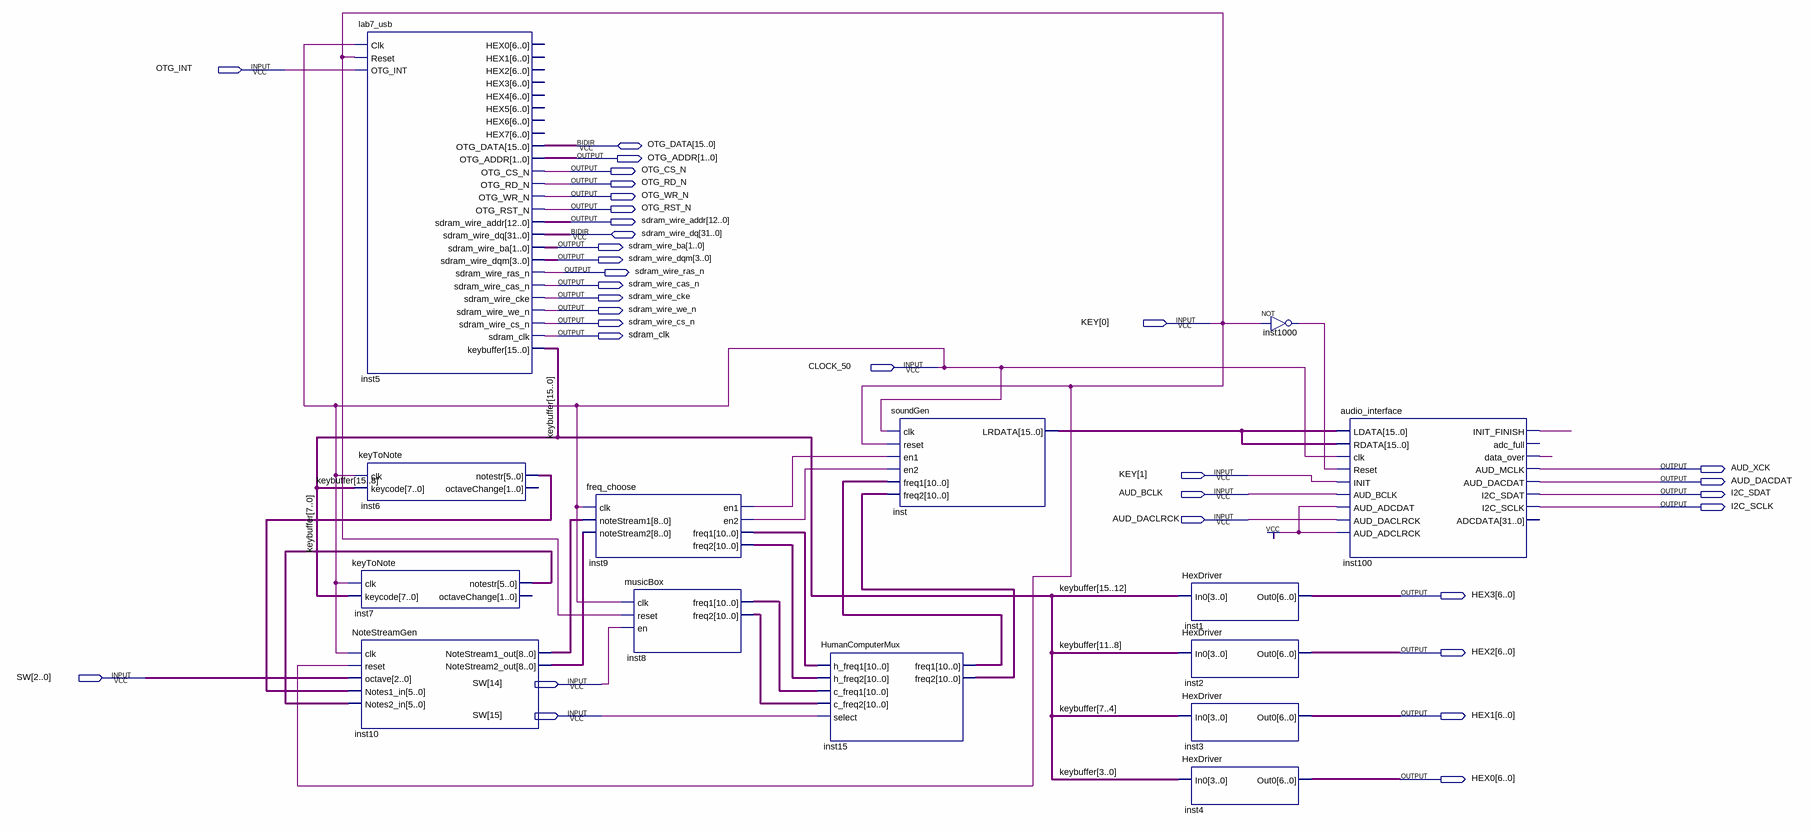
[diagram p0: schematic sheet]
// Quartus schematic Music_Systhesizer.bdf as structural Verilog: 14 symbols, 33 pins
module Music_Systhesizer (
  input  OTG_INT,
  input  [1:0] KEY,
  input  CLOCK_50,
  input  AUD_BCLK,
  input  AUD_DACLRCK,
  input  [15:0] SW,
  inout  [15:0] OTG_DATA,
  inout  [31:0] sdram_wire_dq,
  output [1:0] OTG_ADDR,
  output OTG_CS_N,
  output OTG_RD_N,
  output OTG_WR_N,
  output OTG_RST_N,
  output [12:0] sdram_wire_addr,
  output [1:0] sdram_wire_ba,
  output [3:0] sdram_wire_dqm,
  output sdram_wire_ras_n,
  output sdram_wire_cas_n,
  output sdram_wire_cke,
  output sdram_wire_we_n,
  output sdram_wire_cs_n,
  output sdram_clk,
  output AUD_XCK,
  output AUD_DACDAT,
  output I2C_SDAT,
  output I2C_SCLK,
  output [6:0] HEX3,
  output [6:0] HEX2,
  output [6:0] HEX1,
  output [6:0] HEX0
);

  wire inst9_en1, inst9_en2, inst100_data_over, inst100_init_finish, inst1000_out;
  wire [5:0] inst6_notestr, inst7_notestr;
  wire [8:0] inst10_notestream1_out, inst10_notestream2_out;
  wire [10:0] inst8_freq1, inst8_freq2, inst9_freq1, inst9_freq2, inst15_freq1, inst15_freq2;
  wire [15:0] inst_lrdata, keybuffer;

  lab7_usb inst5 (
    .Clk(CLOCK_50), .Reset(KEY[0]), .OTG_INT(OTG_INT), .OTG_ADDR(OTG_ADDR), .OTG_CS_N(OTG_CS_N),
    .OTG_RD_N(OTG_RD_N), .OTG_WR_N(OTG_WR_N), .OTG_RST_N(OTG_RST_N), .sdram_wire_addr(sdram_wire_addr),
    .sdram_wire_ba(sdram_wire_ba), .sdram_wire_dqm(sdram_wire_dqm), .sdram_wire_ras_n(sdram_wire_ras_n),
    .sdram_wire_cas_n(sdram_wire_cas_n), .sdram_wire_cke(sdram_wire_cke), .sdram_wire_we_n(sdram_wire_we_n),
    .sdram_wire_cs_n(sdram_wire_cs_n), .sdram_clk(sdram_clk), .keybuffer(keybuffer), .OTG_DATA(OTG_DATA),
    .sdram_wire_dq(sdram_wire_dq));  // open: HEX0, HEX1, HEX2, HEX3, HEX4, HEX5, HEX6, HEX7
  keyToNote inst6 (.clk(CLOCK_50), .keycode(keybuffer[15:8]), .notestr(inst6_notestr));  // open: octaveChange
  keyToNote inst7 (.clk(CLOCK_50), .keycode(keybuffer[7:0]), .notestr(inst7_notestr));  // open: octaveChange
  NoteStreamGen inst10 (
    .clk(CLOCK_50), .reset(KEY[0]), .octave(SW[2:0]), .Notes1_in(inst6_notestr), .Notes2_in(inst7_notestr),
    .NoteStream1_out(inst10_notestream1_out), .NoteStream2_out(inst10_notestream2_out));
  freq_choose inst9 (
    .clk(CLOCK_50), .noteStream1(inst10_notestream1_out), .noteStream2(inst10_notestream2_out),
    .en1(inst9_en1), .en2(inst9_en2), .freq1(inst9_freq1), .freq2(inst9_freq2));
  musicBox inst8 (.clk(CLOCK_50), .reset(KEY[0]), .en(SW[14]), .freq1(inst8_freq1), .freq2(inst8_freq2));
  HumanComputerMux inst15 (
    .h_freq1(inst9_freq1), .h_freq2(inst9_freq2), .c_freq1(inst8_freq1), .c_freq2(inst8_freq2),
    .select(SW[15]), .freq1(inst15_freq1), .freq2(inst15_freq2));
  soundGen inst (
    .clk(CLOCK_50), .reset(KEY[0]), .en1(inst9_en1), .en2(inst9_en2), .freq1(inst15_freq1),
    .freq2(inst15_freq2), .LRDATA(inst_lrdata));
  HexDriver inst1 (.In0(keybuffer[15:12]), .Out0(HEX3));
  HexDriver inst2 (.In0(keybuffer[11:8]), .Out0(HEX2));
  HexDriver inst3 (.In0(keybuffer[7:4]), .Out0(HEX1));
  HexDriver inst4 (.In0(keybuffer[3:0]), .Out0(HEX0));
  not inst1000 (inst1000_out, KEY[0]);
  audio_interface inst100 (
    .LDATA(inst_lrdata), .RDATA(inst_lrdata), .clk(CLOCK_50), .Reset(inst1000_out), .INIT(KEY[1]),
    .AUD_BCLK(AUD_BCLK), .AUD_ADCDAT(1'b1), .AUD_DACLRCK(AUD_DACLRCK), .AUD_ADCLRCK(1'b1),
    .INIT_FINISH(inst100_init_finish), .data_over(inst100_data_over), .AUD_MCLK(AUD_XCK),
    .AUD_DACDAT(AUD_DACDAT), .I2C_SDAT(I2C_SDAT), .I2C_SCLK(I2C_SCLK));  // open: adc_full, ADCDATA
endmodule
